# EAGLE design Control (EAGLE 7.2.0)
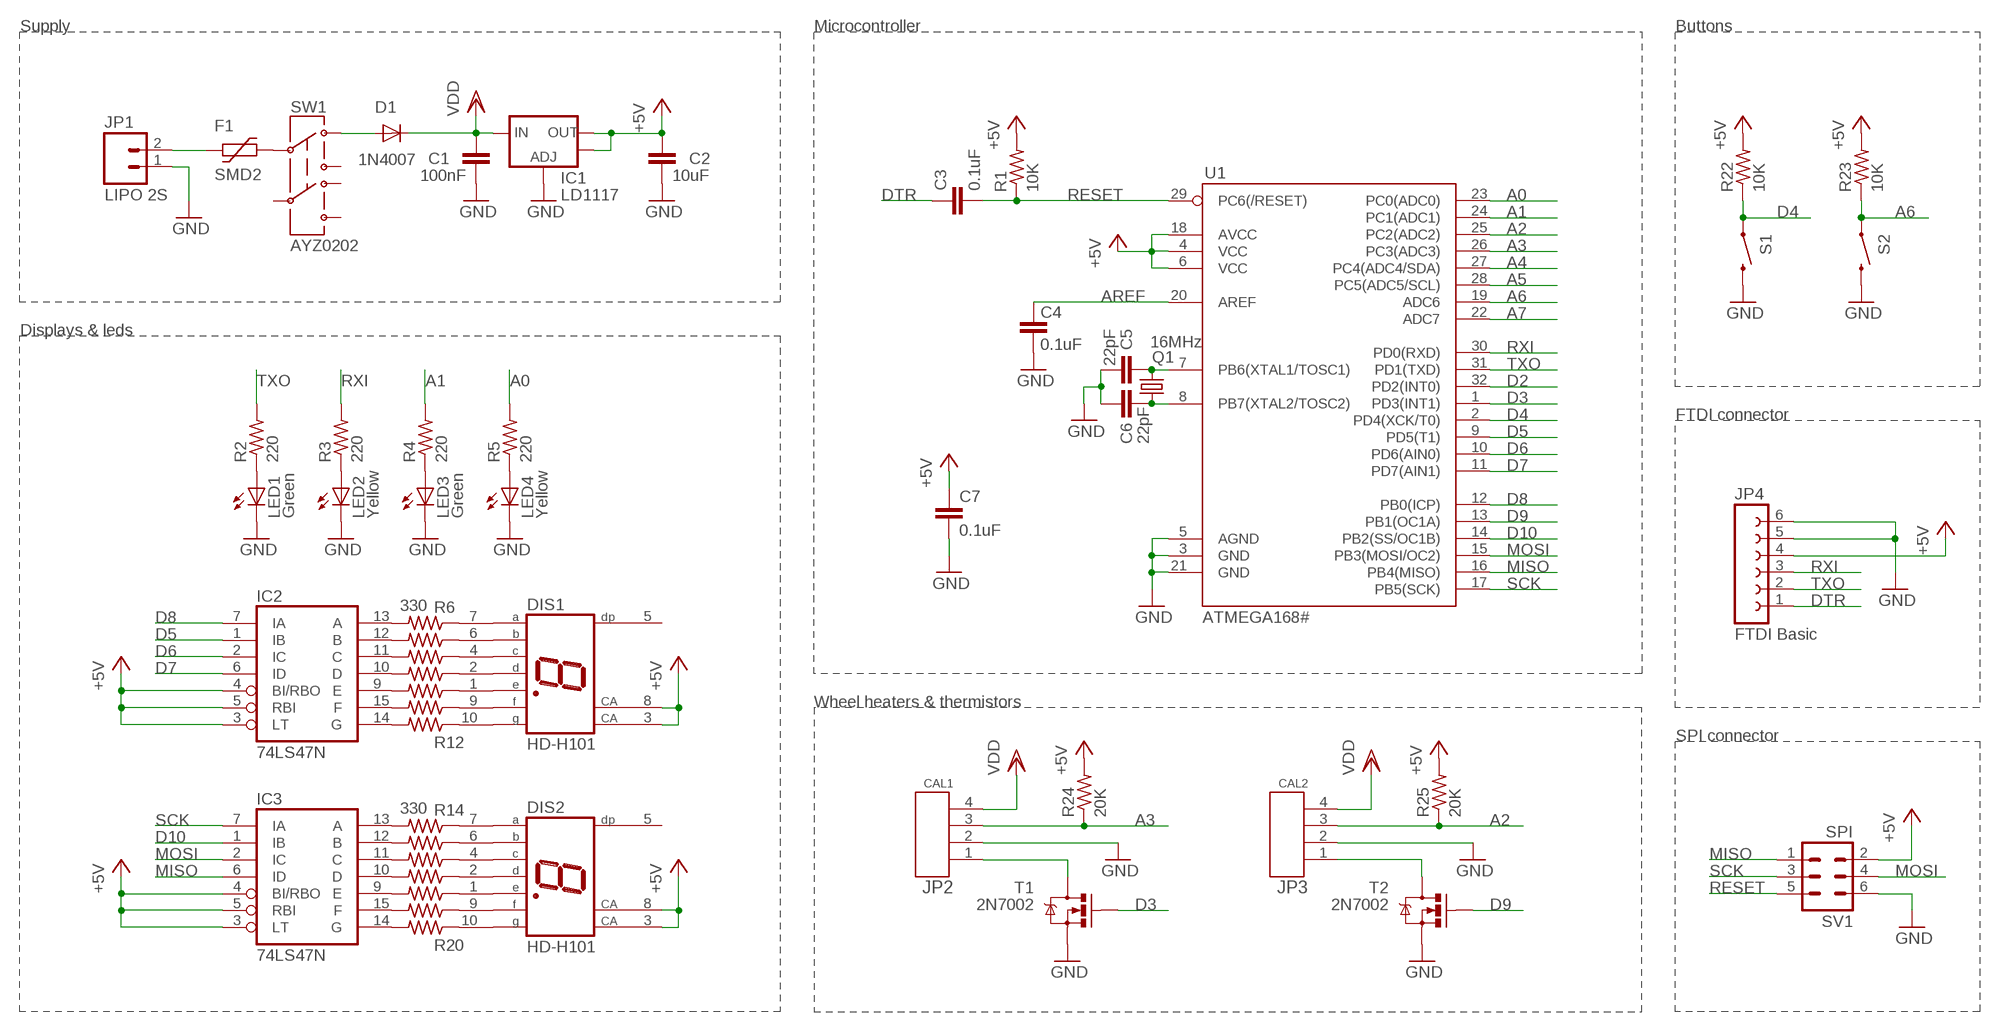
[diagram p0: schematic, sheet 1]

## Parts
C1  100nF  C-EUC0805  [C0805]
C2  10uF  C-EUC0805  [C0805]
C3  0.1uF  C-EUC0805  [C0805]
C4  0.1uF  C-EUC0805  [C0805]
C5  22pF  C-EUC0805  [C0805]
C6  22pF  C-EUC0805  [C0805]
C7  0.1uF  C-EUC0805  [C0805]
D1  1N4007  DIODE-SOD106-R  [SOD106-R]
DIS1  HD-H101  [HDSP-M]
DIS2  HD-H101  [HDSP-M]
F1  SMD2  [SMD2]
IC1  LD1117  V_REG_LM1117SOT223  [SOT223]
IC2  74LS47N  [DIL16]
IC3  74LS47N  [DIL16]
JP1  LIPO 2S  M02NG  [1X02]
JP2  CAL1  4_PINES_RA  [4_PINES_MACHO_TUMBADOS]
JP3  CAL2  4_PINES_RA  [4_PINES_MACHO_TUMBADOS]
JP4  FTDI Basic  FE06W  [FE06W]
LED1  Green  LED3MM  [LED3MM]
LED2  Yellow  LED3MM  [LED3MM]
LED3  Green  LED3MM  [LED3MM]
LED4  Yellow  LED3MM  [LED3MM]
Q1  16MHz  CRYSTALHC49S  [HC49/S]
R1  10K  R-US_R0805  [R0805]
R2  220  R-US_R0805  [R0805]
R3  220  R-US_R0805  [R0805]
R4  220  R-US_R0805  [R0805]
R5  220  R-US_R0805  [R0805]
R6  330  R-US_R0805  [R0805]
R7  330  R-US_R0805  [R0805]
R8  330  R-US_R0805  [R0805]
R9  330  R-US_R0805  [R0805]
R10  330  R-US_R0805  [R0805]
R11  330  R-US_R0805  [R0805]
R12  330  R-US_R0805  [R0805]
R14  330  R-US_R0805  [R0805]
R15  330  R-US_R0805  [R0805]
R16  330  R-US_R0805  [R0805]
R17  330  R-US_R0805  [R0805]
R18  330  R-US_R0805  [R0805]
R19  330  R-US_R0805  [R0805]
R20  330  R-US_R0805  [R0805]
R22  10K  R-US_R0805  [R0805]
R23  10K  R-US_R0805  [R0805]
R24  20K  R-US_R0805  [R0805]
R25  20K  R-US_R0805  [R0805]
S1  SWITCH-MOMENTARY-2PTH  [TACTILE-PTH]
S2  SWITCH-MOMENTARY-2PTH  [TACTILE-PTH]
SV1  SPI  MA03-2  [MA03-2]
SW1  AYZ0202  [AYZ0202]
T1  2N7002  MOSFET-NCHANNELSMD  [SOT23-3]
T2  2N7002  MOSFET-NCHANNELSMD  [SOT23-3]
U1  ATMEGA168#  ATMEGA168  [TQFP32-08]

## Nets
+5V: C2.1 C7.1 DIS1.3(CA) DIS1.8(CA) DIS2.3(CA) DIS2.8(CA) IC1.2(OUT) IC1.4(OUT) IC2.3(LT) IC2.4(BI/RBO) IC2.5(RBI) IC3.3(LT) IC3.4(BI/RBO) IC3.5(RBI) JP4.4 R1.2 R22.2 R23.2 R24.2 R25.2 SV1.2 U1.4(VCC) U1.6(VCC) U1.18(AVCC)
A0: R5.2 U1.23(PC0(ADC0))
A1: R4.2 U1.24(PC1(ADC1))
A2: JP3.3 R25.1 U1.25(PC2(ADC2))
A3: JP2.3 R24.1 U1.26(PC3(ADC3))
A4: U1.27(PC4(ADC4/SDA))
A5: U1.28(PC5(ADC5/SCL))
A6: R23.1 S2.1 U1.19(ADC6)
A7: U1.22(ADC7)
AREF: C4.2 U1.20(AREF)
D2: U1.32(PD2(INT0))
D3: T1.1(G) U1.1(PD3(INT1))
D4: R22.1 S1.1 U1.2(PD4(XCK/T0))
D5: IC2.1(IB) U1.9(PD5(T1))
D6: IC2.2(IC) U1.10(PD6(AIN0))
D7: IC2.6(ID) U1.11(PD7(AIN1))
D8: IC2.7(IA) U1.12(PB0(ICP))
D9: T2.1(G) U1.13(PB1(OC1A))
D10: IC3.1(IB) U1.14(PB2(SS/OC1B))
DTR: C3.1 JP4.1
GND [vcc]: C1.1 C2.2 C4.1 C5.1 C6.1 C7.2 IC1.1(ADJ) JP1.1 JP2.2 JP3.2 JP4.5 JP4.6 LED1.K(C) LED2.K(C) LED3.K(C) LED4.K(C) S1.3 S2.3 SV1.6 T1.2(S) T2.2(S) U1.3(GND) U1.5(AGND) U1.21(GND)
MISO: IC3.6(ID) SV1.1 U1.16(PB4(MISO))
MOSI: IC3.2(IC) SV1.4 U1.15(PB3(MOSI/OC2))
N$1: C6.2 Q1.2 U1.8(PB7(XTAL2/TOSC2))
N$2: C5.2 Q1.1 U1.7(PB6(XTAL1/TOSC1))
N$3: JP2.1 T1.3(D)
N$4: JP3.1 T2.3(D)
N$9: LED2.A R3.1
N$10: LED3.A R4.1
N$11: D1.A SW1.3
N$12: F1.P$2 SW1.2
N$13: F1.P$1 JP1.2
N$14: LED4.A R5.1
N$15: LED1.A R2.1
N$19: IC2.13(A) R6.2
N$20: DIS1.7(A) R6.1
N$21: IC2.12(B) R7.2
N$22: DIS1.6(B) R7.1
N$23: IC2.11(C) R8.2
N$24: DIS1.4(C) R8.1
N$25: IC2.10(D) R9.2
N$28: DIS1.2(D) R9.1
N$29: IC2.9(E) R10.2
N$30: DIS1.1(E) R10.1
N$31: IC2.15(F) R11.2
N$32: DIS1.9(F) R11.1
N$33: IC2.14(G) R12.2
N$34: DIS1.10(G) R12.1
N$42: IC3.13(A) R14.2
N$43: DIS2.7(A) R14.1
N$44: IC3.12(B) R15.2
N$45: DIS2.6(B) R15.1
N$46: IC3.11(C) R16.2
N$47: DIS2.4(C) R16.1
N$48: IC3.10(D) R17.2
N$49: DIS2.2(D) R17.1
N$50: IC3.9(E) R18.2
N$51: DIS2.1(E) R18.1
N$52: IC3.15(F) R19.2
N$53: DIS2.9(F) R19.1
N$54: IC3.14(G) R20.2
N$55: DIS2.10(G) R20.1
RESET: C3.2 R1.1 SV1.5 U1.29(PC6(/RESET))
RXI: JP4.3 R3.2 U1.30(PD0(RXD))
SCK: IC3.7(IA) SV1.3 U1.17(PB5(SCK))
TXO: JP4.2 R2.2 U1.31(PD1(TXD))
VDD: C1.2 D1.C IC1.3(IN) JP2.4 JP3.4
Unconnected: DIS1.5(DP) DIS2.5(DP) SW1.1 SW1.4 SW1.5 SW1.6

## Notes on the sheet
- Supply | Microcontroller | Buttons
- Displays & leds
- FTDI connector
- Wheel heaters & thermistors
- SPI connector

## Power pins joined to a net without a drawn wire
+5V: IC2.16(VCC) IC3.16(VCC)
GND: IC2.8(GND) IC3.8(GND)

## Library data of the parts
C1-C7 = resistor:C-EU: CAPACITOR, European symbol
D1 = diode:DIODE-: DIODE
DIS1 DIS2 = display-hp:HD-H101: LED DISPLAY 1-character 7 segment, decimal point right; OC_FARNELL: unknown; OC_NEWARK: unknown
F1 = Robots:SMD2: RAYCHEM Polyswitch family SMD2 serie
IC1 = SparkFun:V_REG_LM1117: Voltage Regulator LM1117 Standard adjustable voltage regulator but in SMD form. Spark Fun Electronics SKU : COM-00595
IC2 IC3 = 74xx-eu:74*47: BCD to seven segment DECODER/DRIVER Source: http://www.ee.washington.edu/stores/DataSheets/74ls/74ls47.pdf
JP1 = SparkFun:M02NG
JP2 JP3 = Robots:4_PINES
JP4 = con-lsta:FE06W: FEMALE HEADER; OC_FARNELL: unknown; OC_NEWARK: unknown
LED1-LED4 = led:LED: LED OSRAM: - CHIPLED LG R971, LG N971, LY N971, LG Q971, LY Q971, LO R971, LY R971 LH N974, LH R974 LS Q976, LO Q976, LY Q976 LO Q996 - Hyper CHIPLED LW Q18S LB Q993, LB Q99A, LB R99A - SideLED LS A670, LO A670, LY A670, LG A670, LP A670 LB A673, LV A673, LT A673, LW A673 LH A674 LY A675 LS A676, LA A676, LO A676, LY A676, LW A676 LS A679, LY A679, LG A679 - Hyper Micro SIDELED® LS Y876, LA Y876, LO Y876, LY Y876 LT Y87S - SmartLED LW L88C, LW L88S LB L89C, LB L89S, LG L890 LS L89K, LO L89K, LY L89K LS L896, LA L896, LO L896, LY L896 - TOPLED LS T670, LO T670, LY T670, LG T670, LP T670 LSG T670, LSP T670, LSY T670, LOP T670, LYG T670 LG T671, LOG T671, LSG T671 LB T673, LV T673, LT T673, LW T673 LH T674 LS T676, LA T676, LO T676, LY T676, LB T676, LH T676, LSB T676, LW T676 LB T67C, LV T67C, LT T67C, LS T67K, LO T67K, LY T67K, LW E67C LS E67B, LA E67B, LO E67B, LY E67B, LB E67C, LV E67C, LT E67C LW T67C LS T679, LY T679, LG T679 LS T770, LO T770, LY T770, LG T770, LP T770 LB T773, LV T773, LT T773, LW T773 LH T774 LS E675, LA E675, LY E675, LS T675 LS T776, LA T776, LO T776, LY T776, LB T776 LHGB T686 LT T68C, LB T68C - Hyper Mini TOPLED® LB M676 - Mini TOPLED Santana® LG M470 LS M47K, LO M47K, LY M47K Source: http://www.osram.convergy.de LUXEON: - LUMILED® LXK2-PW12-R00, LXK2-PW12-S00, LXK2-PW14-U00, LXK2-PW14-V00 LXK2-PM12-R00, LXK2-PM12-S00, LXK2-PM14-U00 LXK2-PE12-Q00, LXK2-PE12-R00, LXK2-PE12-S00, LXK2-PE14-T00, LXK2-PE14-U00 LXK2-PB12-K00, LXK2-PB12-L00, LXK2-PB12-M00, LXK2-PB14-N00, LXK2-PB14-P00, LXK2-PB14-Q00 LXK2-PR12-L00, LXK2-PR12-M00, LXK2-PR14-Q00, LXK2-PR14-R00 LXK2-PD12-Q00, LXK2-PD12-R00, LXK2-PD12-S00 LXK2-PH12-R00, LXK2-PH12-S00 LXK2-PL12-P00, LXK2-PL12-Q00, LXK2-PL12-R00 Source: www.luxeon.com KINGBRIGHT: KA-3528ASYC Source: www.kingbright.com
Q1 = crystal:CRYSTAL: CRYSTAL; OC_FARNELL: 1667008; OC_NEWARK: unknown
R1-R12 R14-R20 R22-R25 = resistor:R-US_: RESISTOR, American symbol
S1 S2 = SparkFun:SWITCH-MOMENTARY-2
SV1 = con-lstb:MA03-2: PIN HEADER; OC_FARNELL: unknown; OC_NEWARK: unknown
SW1 = SparkFun:AYZ0202: SPDT Slide Switch Simple SMD single-pull double-throw slide switch. Good for less than 350mA power switch, switching UARTs between devices, etc. Spark Fun Electronics SKU : COM-00597
T1 T2 = SparkFun:MOSFET-NCHANNEL
U1 = SparkFun:ATMEGA168

## Net classes
0 default: width 0.203 mm
1 vcc: width 0.254 mm

## Board
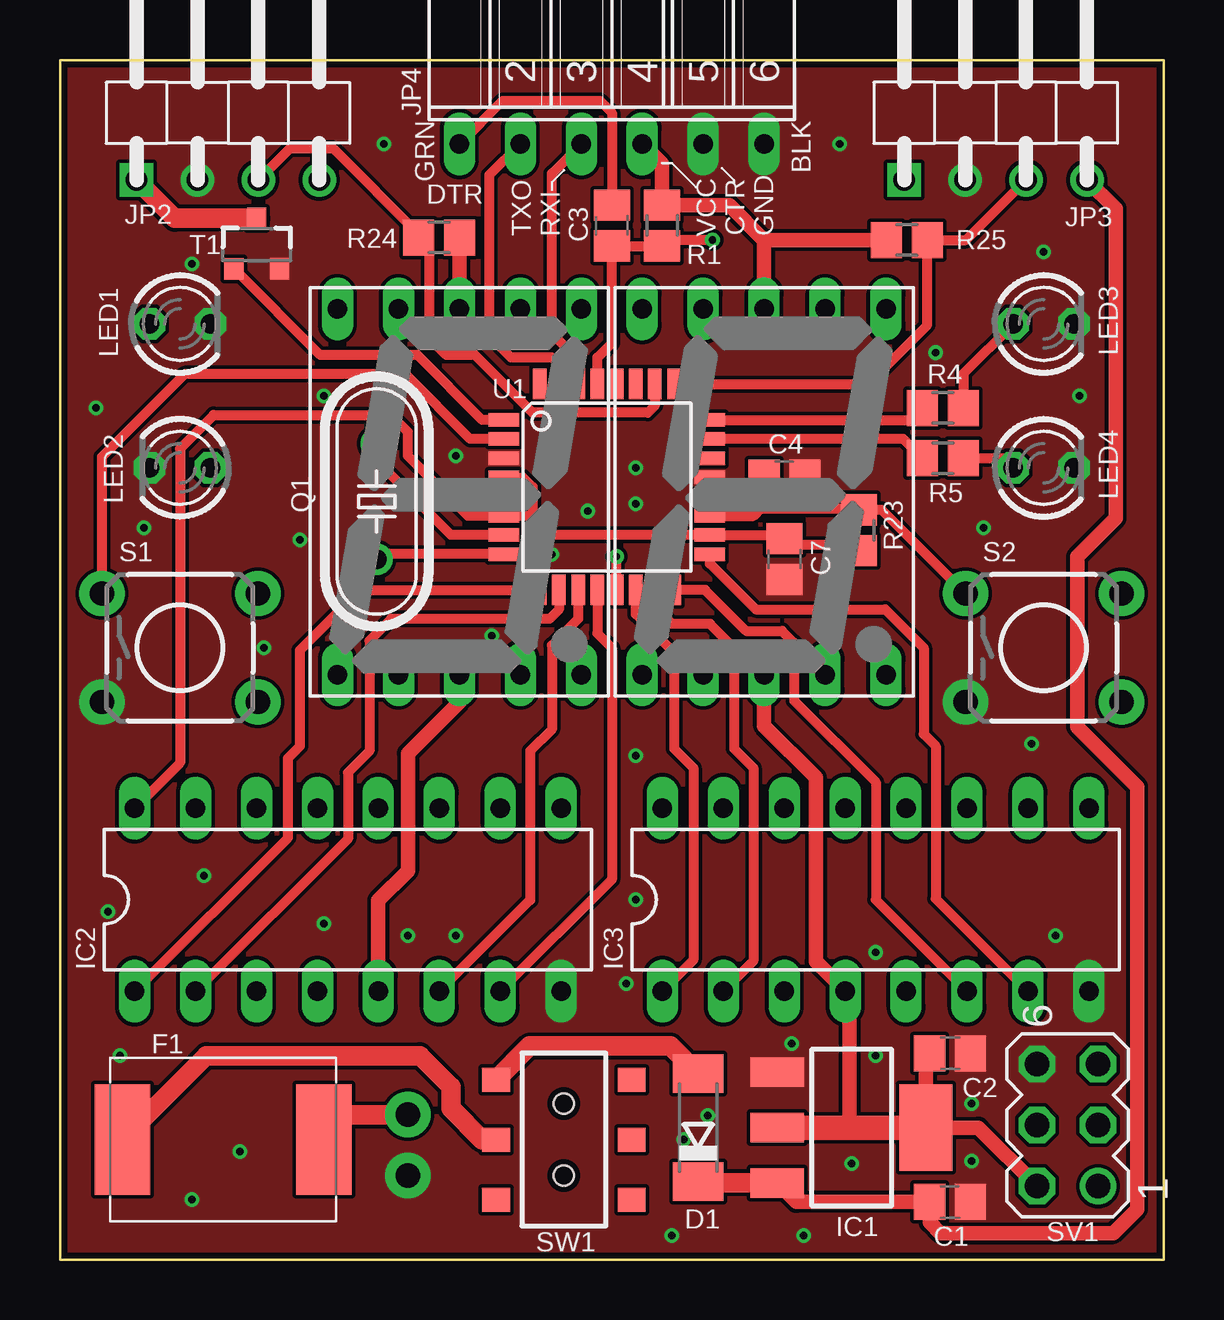
[diagram p1: board, top side]
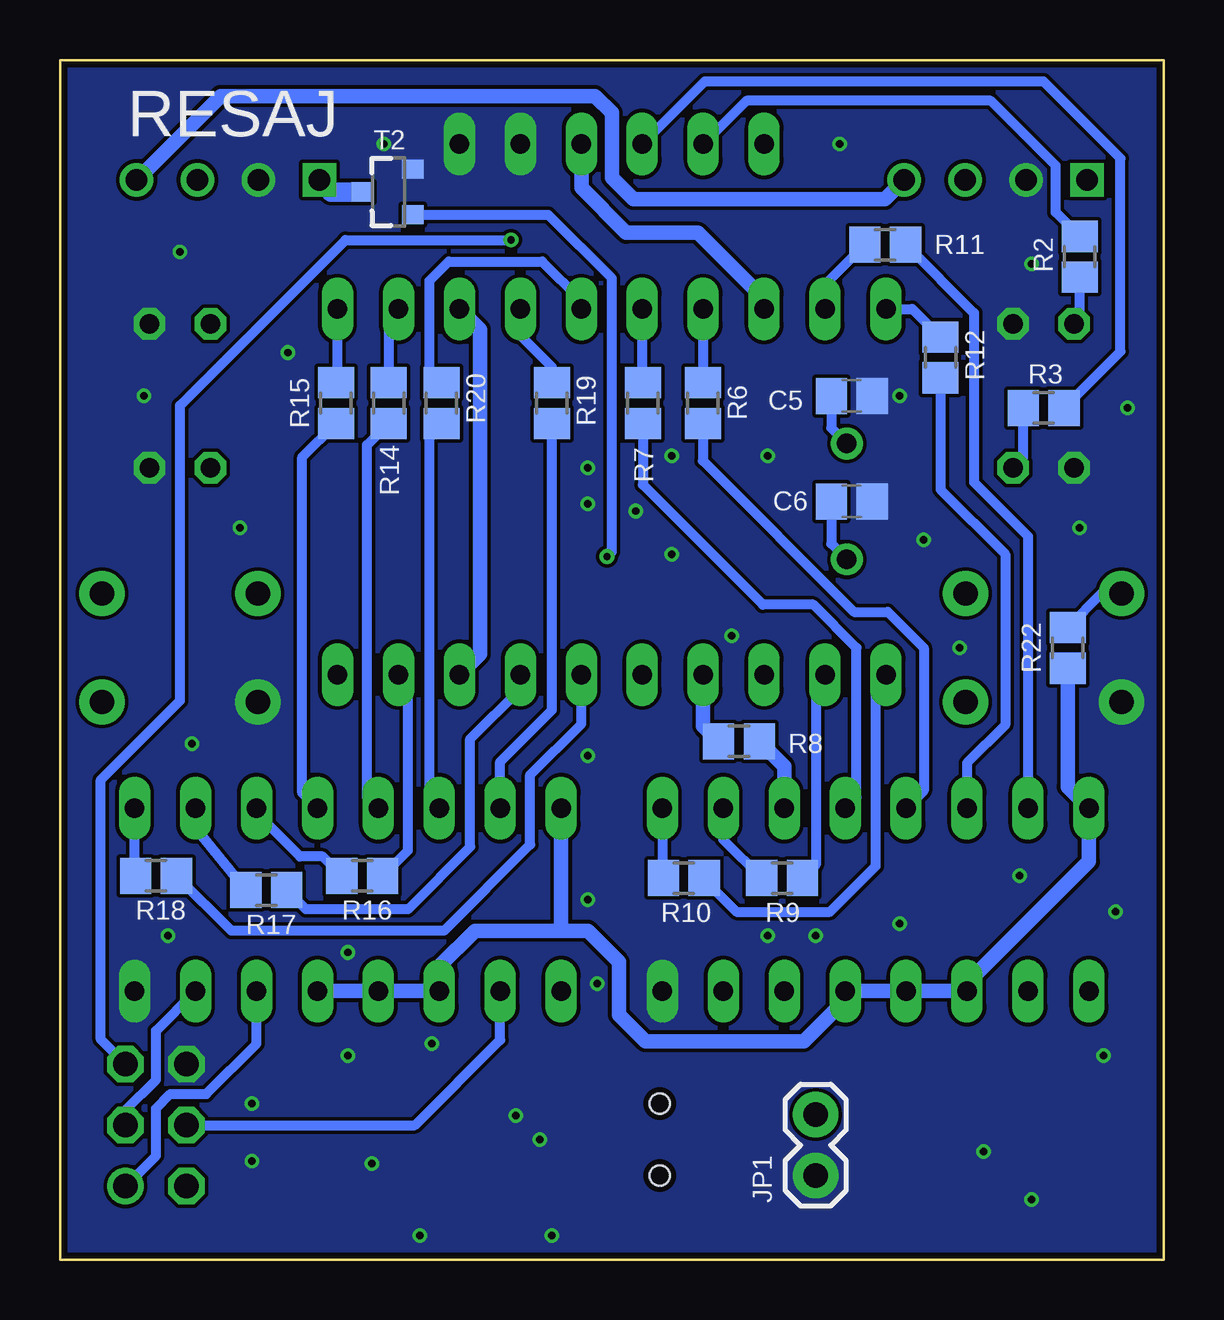
[diagram p2: board, bottom side, seen from below]

Size 46 x 50 mm. Coordinates in mm from the lower left corner, seen from the top.
Outline: 0,50 0,0 46,0 46,50 0,50
Copper layers (1*16): Top 0.035mm / dielectric 1.5mm / Bottom 0.035mm
Design rules "Elecrow_2-layer_eagle_rule": minimum track width 6mil, minimum drill 12mil, track to track 6mil, track to pad 6mil, pad to pad 6mil, via to via 6mil, smd to smd 0mil, copper to edge 10mil, drill to drill 10mil, minimum pad ring 10mil, minimum via ring 6mil, stop-mask expansion 2mil, vias tented up to drill 100mil, thermal gap 10mil

### Footprints (pad centres in the part's own frame; a part is rotated, then mirrored left to right if it is on the bottom)
C0805 = smd 1.3 x 1.5: 1 -0.85,0; 2 0.85,0
SOD106-R = smd 1.6 x 2.1: A 2.25,0; C -2.25,0
HDSP-M = drill 0.813 long: 1 -5.08,-7.62; 2 -2.54,-7.62; 3 0,-7.62; 4 2.54,-7.62; 5 5.08,-7.62; 6 5.08,7.62; 7 2.54,7.62; 8 0,7.62; 9 -2.54,7.62; 10 -5.08,7.62
SMD2 = smd 2.3 x 4.6: P$1 4.2,0; P$2 -4.2,0
SOT223 = smd 1.219 x 2.235: 1 -2.311,-3.099; 2 0,-3.099; 3 2.311,-3.099 | smd 3.6 x 2.2: 4 0,3.099
DIL16 = drill 0.813 long: 1 -8.89,-3.81; 2 -6.35,-3.81; 3 -3.81,-3.81; 4 -1.27,-3.81; 5 1.27,-3.81; 6 3.81,-3.81; 7 6.35,-3.81; 8 8.89,-3.81; 9 8.89,3.81; 10 6.35,3.81; 11 3.81,3.81; 12 1.27,3.81; 13 -1.27,3.81; 14 -3.81,3.81; 15 -6.35,3.81; 16 -8.89,3.81
1X02 = drill 1.016 pad 1.88: 1 0,0; 2 2.54,0
4_PINES_MACHO_TUMBADOS = drill 0.9 square: 1 -3.81,0 | drill 0.9: 2 -1.27,0; 3 1.27,0; 4 3.81,0
FE06W = drill 0.813 long: 1 -6.35,0; 2 -3.81,0; 3 -1.27,0; 4 1.27,0; 5 3.81,0; 6 6.35,0
LED3MM = drill 0.813 octagon: A -1.27,0; K 1.27,0
HC49/S = drill 0.813: 1 -2.413,0; 2 2.413,0
R0805 = smd 1.3 x 1.5: 1 -0.85,0; 2 0.85,0
TACTILE-PTH = drill 1.016 pad 1.88: 1 -3.251,2.261; 2 3.251,2.261; 3 -3.251,-2.261; 4 3.251,-2.261
MA03-2 = drill 1.016: 1 -2.54,-1.27 | drill 1.016 octagon: 2 -2.54,1.27; 3 0,-1.27; 4 0,1.27; 5 2.54,-1.27; 6 2.54,1.27
AYZ0202 = smd 1 x 1.15: 1 -2.5,2.825; 2 0,2.825; 3 2.5,2.825; 4 -2.5,-2.825; 5 0,-2.825; 6 2.5,-2.825 | hole 0.85: 1.5,0; -1.5,0
SOT23-3 = smd 0.8 x 0.9: 1 -0.95,-1; 2 0.95,-1; 3 0,1.1
TQFP32-08 = smd 1.27 x 0.559: 1 -4.293,2.8; 2 -4.293,2; 3 -4.293,1.2; 4 -4.293,0.4; 5 -4.293,-0.4; 6 -4.293,-1.2; 7 -4.293,-2; 8 -4.293,-2.8; 17 4.293,-2.8; 18 4.293,-2; 19 4.293,-1.2; 20 4.293,-0.4; 21 4.293,0.4; 22 4.293,1.2; 23 4.293,2; 24 4.293,2.8 | smd 0.559 x 1.27: 9 -2.8,-4.293; 10 -2,-4.293; 11 -1.2,-4.293; 12 -0.4,-4.293; 13 0.4,-4.293; 14 1.2,-4.293; 15 2,-4.293; 16 2.8,-4.293; 25 2.8,4.293; 26 2,4.293; 27 1.2,4.293; 28 0.4,4.293; 29 -0.4,4.293; 30 -1.2,4.293; 31 -2,4.293; 32 -2.8,4.293

### Placement (x,y rotation side)
C1  37.1,2.4 180 top
C2  37.1,8.6 0 top
C3  23,43.1 270 top
C4  30.2,32.6 180 top
C5  13,36 180 bottom
C6  13,31.6 180 bottom
C7  30.2,29.2 270 top
D1  26.6,5.5 90 top
DIS1  16.65,32 0 top
DIS2  29.35,32 0 top
F1  6.8,5 0 top
IC1  33,5.5 270 top
IC2  12,15 0 top
IC3  34,15 0 top
JP1  14.5,3.5 90 bottom
JP2  7,45 0 top
JP3  39,45 0 top
JP4  23,46.5 0 top
LED1  5,39 0 top
LED2  5,33 180 top
LED3  41,39 0 top
LED4  41,33 0 top
Q1  13.2,31.6 270 top
R1  25.1,43.1 90 top
R2  3.5,41.8 90 bottom
R3  5,35.5 0 bottom
R4  36.8,35.5 180 top
R5  36.8,33.4 180 top
R6  19.2,35.7 270 bottom
R7  21.7,35.7 270 bottom
R8  17.7,21.6 0 bottom
R9  15.9,15.9 180 bottom
R10  20,15.9 180 bottom
R11  11.6,42.3 0 bottom
R12  9.3,37.6 270 bottom
R14  32.3,35.7 270 bottom
R15  34.5,35.7 270 bottom
R16  33.4,16 180 bottom
R17  37.4,15.4 180 bottom
R18  42,16 180 bottom
R19  25.5,35.7 270 bottom
R20  30.1,35.7 270 bottom
R22  4,25.5 270 bottom
R23  33.3,30.4 270 top
R24  15.8,42.6 0 top
R25  35.3,42.5 180 top
S1  5,25.5 0 top
S2  41,25.5 0 top
SV1  42,5.6 90 top
SW1  21,5 90 top
T1  8.2,42.3 0 top
T2  32.3,44.5 90 bottom
U1  22.8,32.2 0 top

### Tracks (layer width: path | path; a pad name or v marks a point on that pad's centre or on a via)
+5V
  Top 0.406: U1.4 19.3,32.6 19.7,32.2 19.7,31 | 19.7,31 U1.6 17,31 14.5,33.5 14.5,34.5 13.8,35.2 6.4,35.2 5,33.8 5,20.7 IC2.16 | 19.7,31 20.5,30.2 U1.18 30.05,30.2 C7.1 30.45,29.8 33.05,29.8 R23.2
  Top 0.61: 32.9,5.5 32.9,11.02 IC3.4 31.5,12.42 31.5,20.1 29.35,22.25 DIS2.3 | DIS1.3 16.65,23.25 14.5,21.1 14.5,16.2 13.27,14.97 IC2.5 | R25.2 29.35,42.5 | 29.35,42.5 DIS2.8 | 29.35,42.5 27.9,43.95 R1.2 25.1,45.67 JP4.4 | DIS1.8 R24.2 | C2.1 36.1,8.45 IC1.4 38.29,5.5 SV1.2
  Top 1.016: IC1.2 32.9,5.5 IC1.4
  Bottom 0.61: IC3.5 IC3.4 IC3.3 30.19,12.21 28.7,13.7 25.11,13.7 | R22.2 4,19.7 IC2.16 3.11,16.59 8.19,11.51 IC2.3 IC2.4 IC2.5 13.27,10.83 15,9.1 21.6,9.1 22.7,10.2 22.7,12.4 24,13.7 25.11,13.7 | IC3.16 25.11,13.7 | DIS2.3 28.5,25.23 28.5,38.77 DIS2.8 | JP4.4 24.27,44.67 22.4,42.8 19.4,42.8 16.65,40.05 DIS1.8
A0
  Top 0.406: R5.2 35.15,34.2 U1.23
A1
  Top 0.406: U1.24 35.45,35 R4.2
A2
  Top 0.406: U1.25 33.69,36.49 36.15,38.95 R25.1 37.77,42.5 JP3.3
A3
  Top 0.406: U1.26 24.8,35.6 24.5,35.3 19.7,35.3 17.3,37.7 16.1,37.7 15.4,38.4 15.4,42.15 R24.1 14.95,42.75 11.4,46.3 9.57,46.3 JP2.3
A6
  Top 0.406: S2.1 34.26,31.25 R23.1 33.25,31.3 29.2,31.3 28.9,31 U1.19
AREF
  Top 0.406: U1.20 28.55,31.8 C4.2
D3
  Top 0.406: T1.1 10.85,37.7 14.9,37.7 17.6,35 U1.1
D4
  Top 0.406: S1.1 1.75,33.45 5.2,36.9 14.4,36.9 17.1,34.2 U1.2
  Bottom 0.406: S1.1 2.59,27.76 R22.1
D5
  Top 0.406: IC2.1 9.5,17.58 9.5,20.9 10,21.4 10,25.4 12.51,27.91 U1.9
D6
  Top 0.406: U1.10 20.8,27.1 20.4,26.7 13.8,26.7 12.9,25.8 12.9,21.2 12,20.3 12,17.54 IC2.2
D7
  Top 0.406: U1.11 21.6,26.7 20.5,25.6 20.5,22.1 19.6,21.2 19.6,14.98 IC2.6
D8
  Top 0.406: U1.12 22.4,26.1 23,25.5 23,15.84 IC2.7
D9  (via drill 0.3)
  Top 0.406: U1.13 v23.2,29.3
  Bottom 0.406: T2.1 25.65,43.55 23,40.9 23,29.5 v23.2,29.3
D10
  Top 0.406: IC3.1 26.4,12.48 26.4,20.5 25.6,21.3 25.6,25.3 24,26.9 U1.14
DTR
  Top 0.406: JP4.1 18.45,48.3 22.5,48.3 23,47.8 C3.1
GND  (via drill 0.3)
  other vias: 5.5,2.5 7.5,4.5 26,5 38,4.1 38,6.5 34,8.5 30.5,9 23.6,11.5 2.5,8.5 14.5,13.5 16.5,13.5 24,15 24,21 34,12.8 41.5,13.5 40.5,21.5 38.5,30.5 42.5,36 41,42 32.5,46.5 13.5,46.5 5.5,41.5 1.5,35.5 3.5,30.5 2,14.5 25.5,1 11,14 6,16 8.5,25.5 10,30 16.5,33.5 11,36 20.5,33.5 24,33 20.5,29.4 18,26 36.5,37.8 24,31.5 22,31.2 27,6 33,4 31,1
  pour Top (no thermals): 0,50 46,50 46,0 0,0
  pour Bottom (no thermals): 0,0 46,0 46,50 0,50
MISO
  Top 0.406: IC3.6 34,15 34,19.9 30.6,23.3 30.6,25.7 30.1,26.2 28.6,26.2 26.89,27.91 U1.16
  Bottom 0.406: SV1.1 42,4.33 42,6.3 41.4,6.9 39.9,6.9 37.81,8.99 IC3.6
MOSI
  Top 0.406: IC3.2 28.9,12.44 28.9,20.5 28.1,21.3 28.1,25.5 27.1,26.5 25.5,26.5 24.8,27.2 U1.15
  Bottom 0.406: SV1.4 31.2,5.6 27.65,9.15 IC3.2
N$1
  Top 0.406: U1.8 13.41,29.4 Q1.2
  Bottom 0.406: C6.2 13.85,29.84 Q1.2
N$2
  Top 0.406: Q1.1 13.2,33.3 16.3,30.2 U1.7
  Bottom 0.406: C5.2 13.85,34.66 Q1.1
N$3
  Top 0.813: T1.3 4.79,43.4 JP2.1
N$4
  Bottom 0.813: T2.3 34.69,44.5 JP3.1
N$9
  Bottom 0.406: LED2.A 5.85,33.42 R3.1
N$10
  Top 0.406: LED3.A 37.65,36.92 R4.1
N$11
  Top 0.813: SW1.3 19.57,8.9 25.45,8.9 D1.A
N$12
  Top 0.813: 18.18,5.03 SW1.2 17.6,5 16.3,6.3 16.3,7.2 15,8.5 6.1,8.5 F1.P$2
N$13
  Top 0.813: F1.P$1 12.04,6.04 JP1.2
N$14
  Top 0.406: R5.1 39.33,33.4 LED4.A
N$15
  Bottom 0.406: LED1.A 3.5,39.23 R2.1
N$19
  Bottom 0.406: IC2.13 10,19.54 10,25.5 11.5,27 12.9,27 19.2,33.3 R6.2
N$20
  Bottom 0.406: DIS1.7 R6.1
N$21
  Bottom 0.406: R7.2 21.7,32.3 16.7,27.3 14.6,27.3 12.8,25.5 12.8,19.28 IC2.12
N$22
  Bottom 0.406: DIS1.6 21.73,36.58 R7.1
N$23
  Bottom 0.61: R8.2 15.81,20.56 IC2.11
N$24
  Bottom 0.61: DIS1.4 19.19,22.24 R8.1
N$25
  Bottom 0.406: IC2.10 18.35,17.5 R9.2
N$28
  Bottom 0.406: DIS1.2 14.5,23.99 14.5,16.45 R9.1
N$29
  Bottom 0.406: IC2.9 20.89,15.94 R10.2
N$30
  Bottom 0.406: R10.1 19.15,15.85 17.8,14.5 13.9,14.5 12,16.4 12,23.95 DIS1.1
N$31
  Bottom 0.406: IC2.15 5.65,30.15 7.9,32.4 7.9,39.45 R11.2
N$32
  Bottom 0.406: DIS1.9 14.11,40.64 R11.1
N$33
  Bottom 0.406: IC2.14 8.19,20.69 6.6,22.28 6.6,29.4 9.3,32.1 R12.2
N$34
  Bottom 0.406: DIS1.10 10.47,39.62 R12.1
N$42
  Bottom 0.406: IC3.13 33.2,19.28 33.2,33.95 R14.2
N$43
  Bottom 0.406: DIS2.7 32.3,39.21 R14.1
N$44
  Bottom 0.406: IC3.12 35.9,19.44 35.9,33.45 R15.2
N$45
  Bottom 0.406: R15.1 34.43,36.62 DIS2.6
N$46
  Bottom 0.406: R16.2 35.05,16.8 36,16.8 37.81,18.61 IC3.11
N$47
  Bottom 0.406: R16.1 31.5,17.05 31.5,23.99 DIS2.4
N$48
  Bottom 0.406: R17.2 40.35,18 IC3.10
N$49
  Bottom 0.406: DIS2.2 26.81,23.79 28.9,21.7 28.9,17.2 31.5,14.6 35.75,14.6 R17.1
N$50
  Bottom 0.406: R18.2 42.89,16.04 IC3.9
N$51
  Bottom 0.406: R18.1 38.85,13.7 30,13.7 26.4,17.3 26.4,20.2 24.27,22.33 DIS2.1
N$52
  Bottom 0.406: IC3.15 27.65,20.75 25.5,22.9 R19.2
N$53
  Bottom 0.406: R19.1 25.5,37.2 26.81,38.51 DIS2.9
N$54
  Bottom 0.406: IC3.14 30.6,19.22 30.6,34.35 R20.2
N$55
  Bottom 0.406: DIS2.10 24.27,39.97 25.9,41.6 29.8,41.6 30.6,40.8 30.6,37.05 R20.1
RESET  (via drill 0.3)
  Top 0.406: U1.29 22.4,37.6 23,38.2 C3.2 R1.1 25.35,42.5 v27.2,42.5
  Bottom 0.406: SV1.5 44.3,9.17 44.3,20 41,23.3 41,35.6 34.1,42.5 v27.2,42.5
RXI
  Top 0.406: U1.30 21.6,37.5 20.5,38.6 20.5,45.27 JP4.3
  Bottom 0.406: JP4.3 19.13,49.1 5,49.1 1.8,45.9 1.8,37.85 R3.2
SCK
  Top 0.406: IC3.7 36.5,15.04 36.5,21.4 36,21.9 36,25.5 34.4,27.1 29,27.1 27.09,29.01 U1.17
  Bottom 0.406: SV1.3 43.27,6.23 42,7.5 42,9.54 IC3.7
TXO
  Top 0.406: U1.31 20.8,37.3 20.5,37.6 18.8,37.6 17.9,38.5 17.9,45.21 JP4.2
  Bottom 0.406: R2.2 4.5,43.65 4.5,45.6 7.2,48.3 17.39,48.3 JP4.2
VDD
  Top 0.61: IC1.3 30.69,2.4 C1.2 36.25,1.55 36.7,1.1 43.9,1.1 44.9,2.1 44.9,19.7 42.4,22.2 42.4,29.3 44,30.9 44,43.81 JP3.4
  Top 0.813: IC1.3 26.66,3.19 D1.C
  Bottom 0.61: JP2.4 11.61,44.2 22.1,44.2 23,45.1 23,47.8 23.7,48.5 39.31,48.5 JP3.4

### Text on the board
tPlace: GRN | BLK | DTR | TXO | RXI | VCC | CTR | GND
bPlace: RESAJ